# EAGLE design caja_negra (EAGLE 9.6.2)
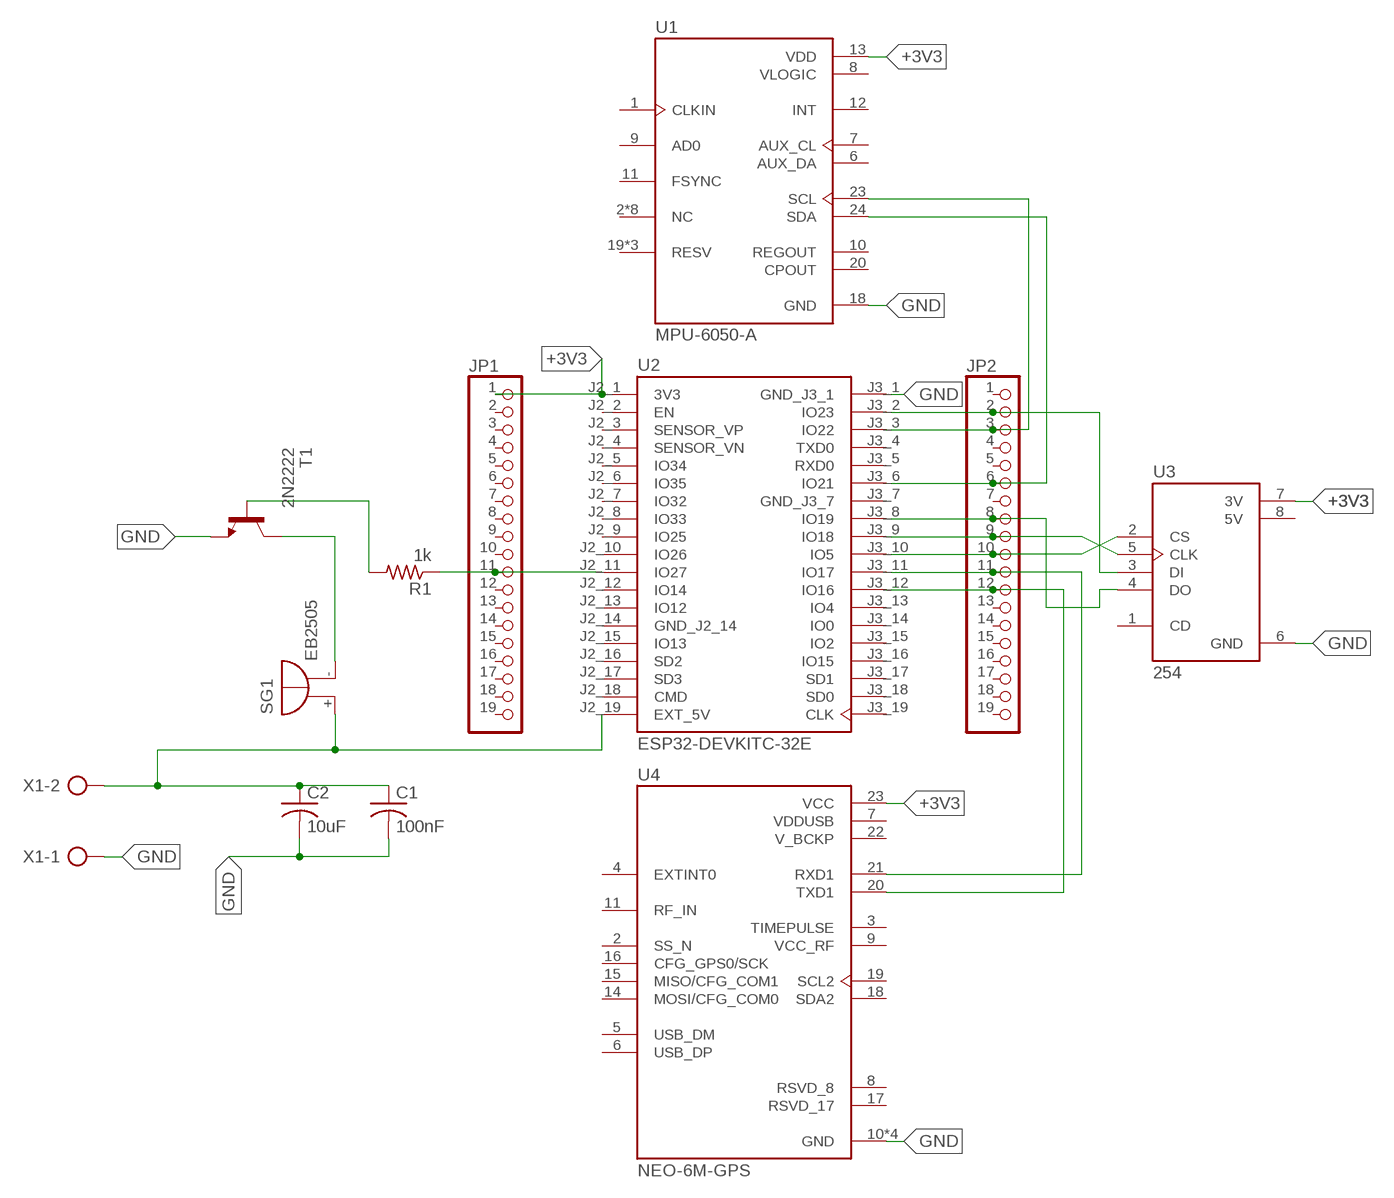
[diagram p0: schematic, sheet 1]

## Parts
C1  100nF  C-US025-024X044  [C025-024X044]
C2  10uF  C-US025-024X044  [C025-024X044]
JP1  PINHD-1X19  [1X19]
JP2  PINHD-1X19  [1X19]
R1  1k  R-US_0204/2V  [0204V]
SG1  EB2505  [EB2505]
T1  2N2222  [TO18]
U1  MPU-6050-A  [QFN50P400X400X95-24N]
U2  ESP32-DEVKITC-32E  [MODULE_ESP32-DEVKITC-32E]
U3  254  [MODULE_254]
U4  NEO-6M-GPS  [XCVR_NEO-6M-GPS]
X1  AK500/2-H  [AK500/2-H]

## Nets
+3V3: JP1.1 U1.13(VDD) U2.J2_1(3V3) U3.7(3V) U4.23(VCC)
GND: C1.2 C2.2 T1.1(E) U1.18(GND) U2.J3_1(GND_J3_1) U3.6(GND) U4.10(GND) U4.12(GND) U4.13(GND) U4.24(GND) X1.1
N$1: JP2.6 U1.24(SDA) U2.J3_6(IO21)
N$2: JP2.3 U1.23(SCL) U2.J3_3(IO22)
N$3: JP2.12 U2.J3_12(IO16) U4.20(TXD1)
N$4: JP2.11 U2.J3_11(IO17) U4.21(RXD1)
N$5: JP2.2 U2.J3_2(IO23) U3.3(DI)
N$6: JP2.10 U2.J3_10(IO5) U3.2(CS)
N$7: JP2.9 U2.J3_9(IO18) U3.5(CLK)
N$8: JP2.8 U2.J3_8(IO19) U3.4(DO)
N$9: JP1.11 R1.1 U2.J2_11(IO27)
N$11: C1.1 C2.1 SG1.+ U2.J2_19(EXT_5V) X1.2
N$12: SG1.- T1.3(C)
N$13: R1.2 T1.2(B)
Unconnected: JP1.2 JP1.3 JP1.4 JP1.5 JP1.6 JP1.7 JP1.8 JP1.9 JP1.10 JP1.12 JP1.13 JP1.14 JP1.15 JP1.16 JP1.17 JP1.18 JP1.19 JP2.1 JP2.4 JP2.5 JP2.7 JP2.13 JP2.14 JP2.15 JP2.16 JP2.17 JP2.18 JP2.19 U1.1(CLKIN) U1.2(NC) U1.3(NC) U1.4(NC) U1.5(NC) U1.6(AUX_DA) U1.7(AUX_CL) U1.9(AD0) U1.10(REGOUT) U1.11(FSYNC) U1.12(INT) U1.14(NC) U1.15(NC) U1.16(NC) U1.17(NC) U1.19(RESV) U1.20(CPOUT) U1.21(RESV) U1.22(RESV) U2.J2_2(EN) U2.J2_3(SENSOR_VP) U2.J2_4(SENSOR_VN) U2.J2_5(IO34) U2.J2_6(IO35) U2.J2_7(IO32) U2.J2_8(IO33) U2.J2_9(IO25) U2.J2_10(IO26) U2.J2_12(IO14) U2.J2_13(IO12) U2.J2_15(IO13) U2.J2_16(SD2) U2.J2_17(SD3) U2.J2_18(CMD) U2.J3_4(TXD0) U2.J3_5(RXD0) U2.J3_13(IO4) U2.J3_14(IO0) U2.J3_15(IO2) U2.J3_16(IO15) U2.J3_17(SD1) U2.J3_18(SD0) U2.J3_19(CLK) U3.1(CD) U4.2(SS_N) U4.3(TIMEPULSE) U4.4(EXTINT0) U4.5(USB_DM) U4.6(USB_DP) U4.8(RSVD_8) U4.9(VCC_RF) U4.11(RF_IN) U4.14(MOSI/CFG_COM0) U4.15(MISO/CFG_COM1) U4.16(CFG_GPS0/SCK) U4.17(RSVD_17) U4.18(SDA2) U4.19(SCL2)

## Power pins joined to a net without a drawn wire
5V: U3.8(5V)
GND_J2_14: U2.J2_14(GND_J2_14)
GND_J3_7: U2.J3_7(GND_J3_7)
V_BCKP: U4.22(V_BCKP)
VDDUSB: U4.7(VDDUSB)
VLOGIC: U1.8(VLOGIC)

## Library data of the parts
C1 C2 = rcl:C-US: CAPACITOR, American symbol; SPICEPREFIX: C
JP1 JP2 = pinhead:PINHD-1X19: PIN HEADER
R1 = rcl:R-US_: RESISTOR, American symbol; SPICEPREFIX: R
SG1 = buzzer:EB2505: BUZZER Source: Buerklin; OC_FARNELL: unknown; OC_NEWARK: unknown
T1 = transistor:2N2222: NPN TRANSISTOR
U1 = MPU-6050-A:MPU-6050-A: Check availability <https://pricing.snapeda.com/parts/MPU-6050-A/TDK%20InvenSense/view-part?ref=eda>; AVAILABILITY: In Stock; CHECK_PRICES: https://www.snapeda.com/parts/MPU-6050-A/TDK/view-part/?ref=eda; DESCRIPTION: MOTION TRACKING DEVICE; MF: TDK InvenSense; MP: MPU-6050-A; PACKAGE: QFN-24 InvenSense; PRICE: None; SNAPEDA_LINK: https://www.snapeda.com/parts/MPU-6050-A/TDK/view-part/?ref=snap
U2 = ESP32-DEVKITC-32E:ESP32-DEVKITC-32E: Check availability <https://pricing.snapeda.com/parts/ESP32-DEVKITC-32E/Espressif%20Systems/view-part?ref=eda>; AVAILABILITY: In Stock; CHECK_PRICES: https://www.snapeda.com/parts/ESP32-DEVKITC-32E/Espressif+Systems/view-part/?ref=eda; DESCRIPTION: The ESP32-DEVKITC-32E transceiver evaluation board from Espressif Systems is a powerful development tool for wireless communication technologies. It supports 802.11 b/g/n Wi-Fi and Bluetooth® Smart Ready 4.x (BLE) dual-mode at 2.4GHz, making it ideal for a variety of IoT applications. Equipped with a PCB antenna and 4MB flash, this board provides reliable connectivity and ample memory for developing and testing RF, RFID, and wireless solutions.; MF: Espressif Systems; MP: ESP32-DEVKITC-32E; PACKAGE: None; PRICE: None; PURCHASE-URL: https://www.snapeda.com/api/url_track_click_mouser/?unipart_id=4719025&manufacturer=Espressif Systems&part_name=ESP32-DEVKITC-32E&search_term=esp32 devkit; SNAPEDA_LINK: https://www.snapeda.com/parts/ESP32-DEVKITC-32E/Espressif+Systems/view-part/?ref=snap
U3 = 254:254: Check availability <https://pricing.snapeda.com/parts/254/Adafruit/view-part?ref=eda>; AVAILABILITY: In Stock; CHECK_PRICES: https://www.snapeda.com/parts/254/Adafruit+Industries/view-part/?ref=eda; DESCRIPTION: MicroSD card breakout board+ | Adafruit Industries 254; MF: Adafruit; MP: 254; PACKAGE: NON STANDARD Adafruit; PRICE: None; PURCHASE-URL: https://www.snapeda.com/api/url_track_click_mouser/?unipart_id=4653161&manufacturer=Adafruit&part_name=254&search_term=microsd (spi); SNAPEDA_LINK: https://www.snapeda.com/parts/254/Adafruit+Industries/view-part/?ref=snap
U4 = NEO-6M-GPS:NEO-6M-GPS: Check availability <https://pricing.snapeda.com/parts/NEO-6M-GPS/u-blox/view-part?ref=eda>; AVAILABILITY: Not in stock; CHECK_PRICES: https://www.snapeda.com/parts/NEO-6M-GPS/u-blox/view-part/?ref=eda; DESCRIPTION: GPS Development Tools SparkFun GNSS-RTK Dead Reckoning Breakout - ZED-F9K (Qwiic); MF: u-blox; MP: NEO-6M-GPS; PACKAGE: None; PRICE: None; SNAPEDA_LINK: https://www.snapeda.com/parts/NEO-6M-GPS/u-blox/view-part/?ref=snap
X1 = con-ptr500:AK500/2-H: CONNECTOR Aug. 2004 / PTR Meßtechnik: Die Bezeichnung der Serie AK505 wurde geändert. Es handelt sich hierbei um AK500 in horizontaler Ausführung.; OC_FARNELL: unknown; OC_NEWARK: unknown

## Board
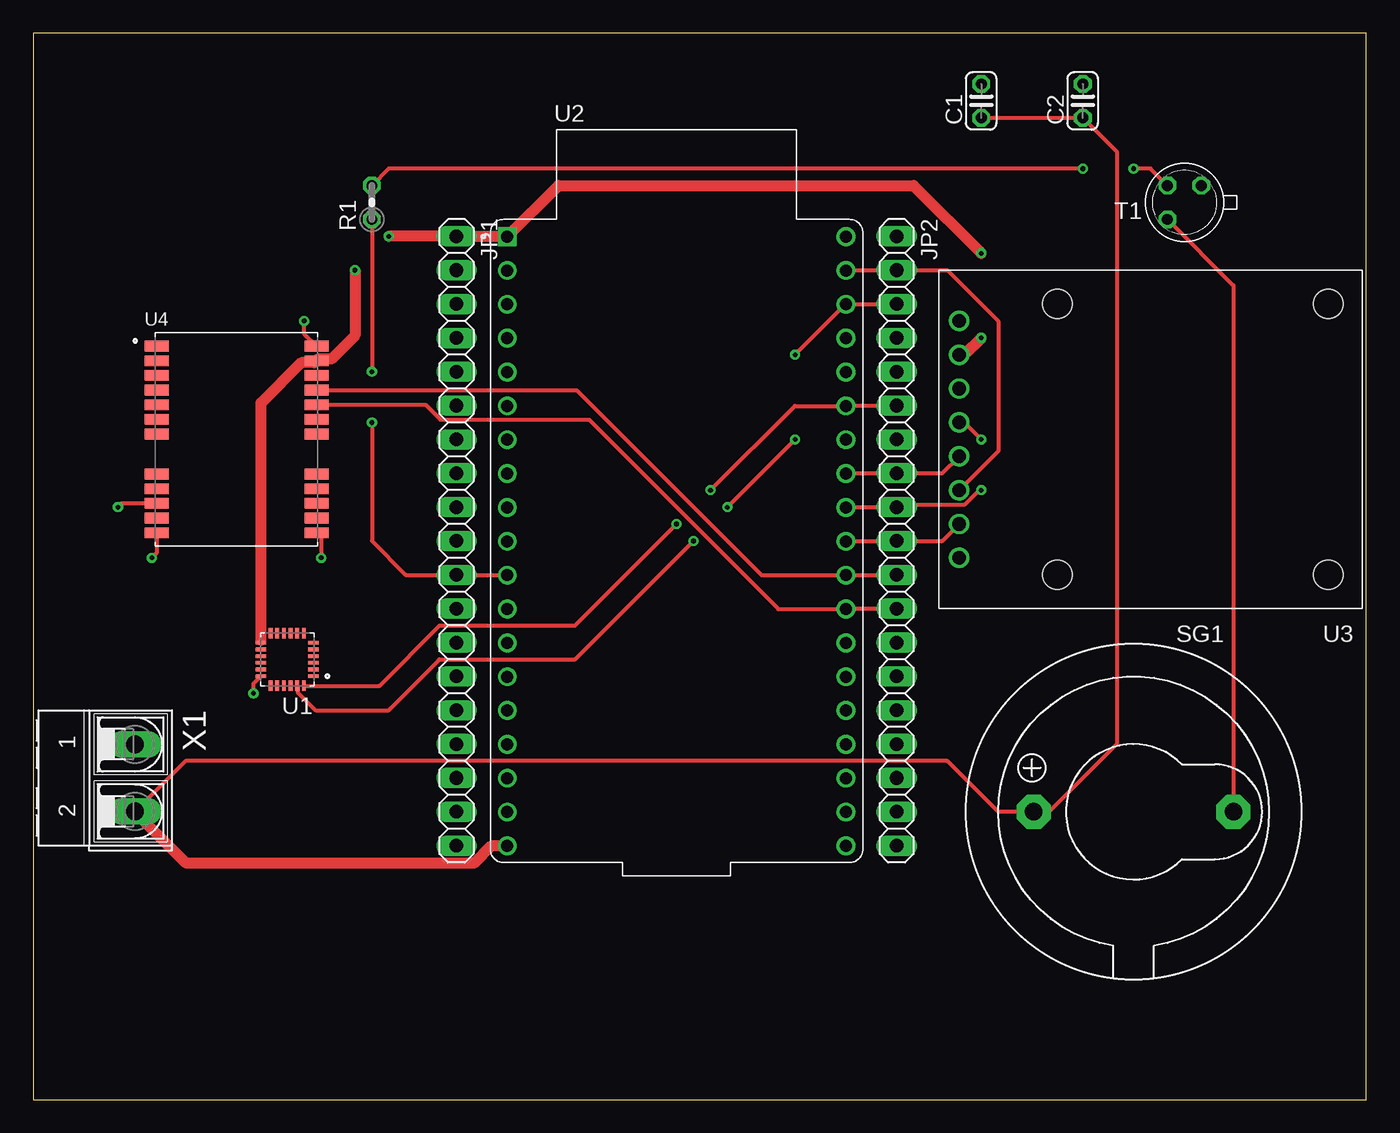
[diagram p1: board, top side]
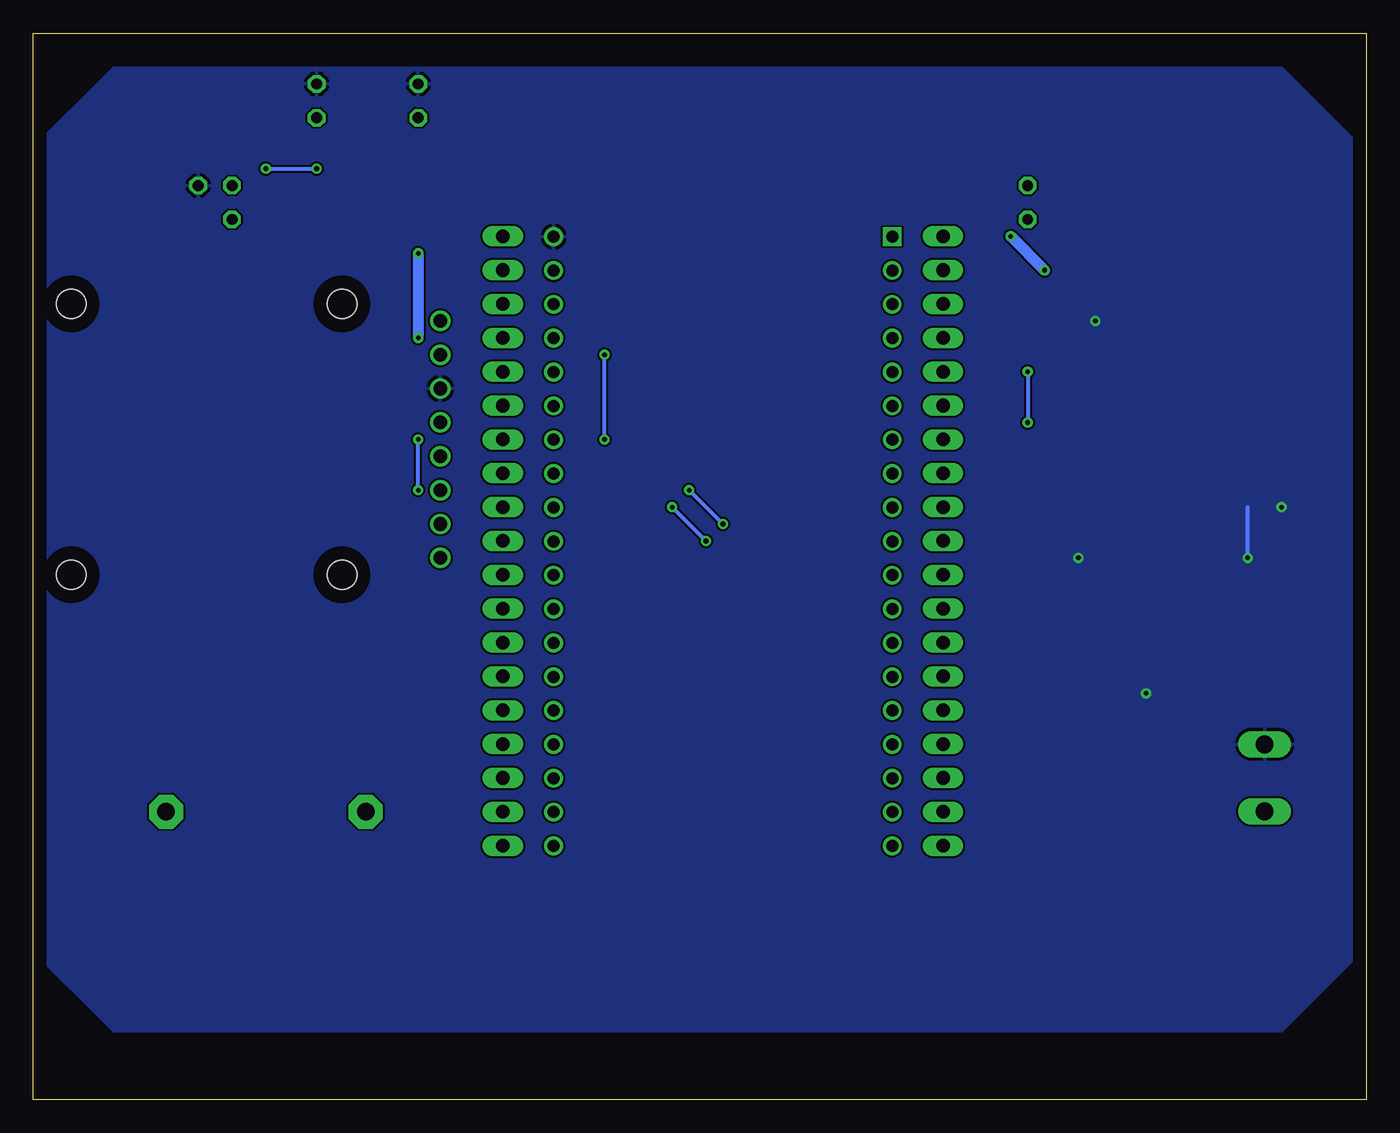
[diagram p2: board, bottom side, seen from below]

Size 100 x 80 mm. Coordinates in mm from the lower left corner, seen from the top.
Outline: 0,0 100,0 100,80 0,80 0,0
Copper layers (1*16): Top 0.035mm / dielectric 1.5mm / Bottom 0.035mm
Design rules "default": minimum track width 6mil, minimum drill 0.35mm, track to track 6mil, track to pad 6mil, pad to pad 6mil, via to via 6mil, smd to smd 6mil, copper to edge 40mil, drill to drill 6mil, minimum pad ring 10mil, minimum via ring 8mil, stop-mask expansion 4mil, vias tented up to drill 0mil, thermal gap 10mil

### Footprints (pad centres in the part's own frame; a part is rotated, then mirrored left to right if it is on the bottom)
C025-024X044 = drill 0.813 octagon: 1 -1.27,0; 2 1.27,0
1X19 = drill 1.016 long: 1 -22.86,0; 2 -20.32,0; 3 -17.78,0; 4 -15.24,0; 5 -12.7,0; 6 -10.16,0; 7 -7.62,0; 8 -5.08,0; 9 -2.54,0; 10 0,0; 11 2.54,0; 12 5.08,0; 13 7.62,0; 14 10.16,0; 15 12.7,0; 16 15.24,0; 17 17.78,0; 18 20.32,0; 19 22.86,0
0204V = drill 0.813 octagon: 1 -1.27,0; 2 1.27,0
EB2505 = drill 1.321 pad 2.54 octagon: + -7.493,0; - 7.493,0
TO18 = drill 0.813 octagon: 1 -1.27,-1.27; 2 1.27,-1.27; 3 1.27,1.27
QFN50P400X400X95-24N = smd 0.79 x 0.28: 1 -1.97,1.25; 2 -1.97,0.75; 3 -1.97,0.25; 4 -1.97,-0.25; 5 -1.97,-0.75; 6 -1.97,-1.25; 13 1.97,-1.25; 14 1.97,-0.75; 15 1.97,-0.25; 16 1.97,0.25; 17 1.97,0.75; 18 1.97,1.25 | smd 0.28 x 0.79: 7 -1.25,-1.97; 8 -0.75,-1.97; 9 -0.25,-1.97; 10 0.25,-1.97; 11 0.75,-1.97; 12 1.25,-1.97; 19 1.25,1.97; 20 0.75,1.97; 21 0.25,1.97; 22 -0.25,1.97; 23 -0.75,1.97; 24 -1.25,1.97
MODULE_ESP32-DEVKITC-32E = drill 0.9 square: J2_1 -12.7,22.835 | drill 0.9: J2_2 -12.7,20.295; J2_3 -12.7,17.755; J2_4 -12.7,15.215; J2_5 -12.7,12.675; J2_6 -12.7,10.135; J2_7 -12.7,7.595; J2_8 -12.7,5.055; J2_9 -12.7,2.515; J2_10 -12.7,-0.025; J2_11 -12.7,-2.565; J2_12 -12.7,-5.105; J2_13 -12.7,-7.645; J2_14 -12.7,-10.185; J2_15 -12.7,-12.725; J2_16 -12.7,-15.265; J2_17 -12.7,-17.805; J2_18 -12.7,-20.345; J2_19 -12.7,-22.885; J3_1 12.7,22.835; J3_2 12.7,20.295; J3_3 12.7,17.755; J3_4 12.7,15.215; J3_5 12.7,12.675; J3_6 12.7,10.135; J3_7 12.7,7.595; J3_8 12.7,5.055; J3_9 12.7,2.515; J3_10 12.7,-0.025; J3_11 12.7,-2.565; J3_12 12.7,-5.105; J3_13 12.7,-7.645; J3_14 12.7,-10.185; J3_15 12.7,-12.725; J3_16 12.7,-15.265; J3_17 12.7,-17.805; J3_18 12.7,-20.345; J3_19 12.7,-22.885
MODULE_254 = drill 1.02: 1 14.351,8.89; 2 14.351,6.35; 3 14.351,3.81; 4 14.351,1.27; 5 14.351,-1.27; 6 14.351,-3.81; 7 14.351,-6.35; 8 14.351,-8.89 | hole 2.2: -13.335,10.16; 6.985,10.16; 6.985,-10.16; -13.335,-10.16
XCVR_NEO-6M-GPS = smd 1.8 x 0.8: 1 -6,7; 2 -6,5.9; 3 -6,4.8; 4 -6,3.7; 5 -6,2.6; 6 -6,1.5; 7 -6,0.4; 8 -6,-2.6; 9 -6,-3.7; 10 -6,-4.8; 11 -6,-5.9; 12 -6,-7; 13 6,-7; 14 6,-5.9; 15 6,-4.8; 16 6,-3.7; 17 6,-2.6; 18 6,0.4; 19 6,1.5; 20 6,2.6; 21 6,3.7; 22 6,4.8; 23 6,5.9; 24 6,7
AK500/2-H = drill 1.321 long: 1 -2.515,0; 2 2.515,0

### Placement (x,y rotation side)
C1  71.12,74.93 90 top
C2  78.74,74.93 90 top
JP1  31.75,41.91 270 top
JP2  64.77,41.91 270 top
R1  25.4,67.31 90 top
SG1  82.55,21.59 0 top
T1  86.36,67.31 180 top
U1  19.05,33.02 180 top
U2  48.26,41.91 0 top
U3  83.82,49.53 180 top
U4  15.24,49.53 0 top
X1  7.62,24.13 270 top

### Tracks (layer width: path | path; a pad name or v marks a point on that pad's centre or on a via)
+3V3  (via drill 0.35)
  Top 0.305: U1.13 17.08,34.47
  Top 0.813: v26.67,64.77 JP1.1 31.77,64.75 U2.J2_1 39.4,68.58 66.04,68.58 v71.12,63.5 | v24.13,62.23 24.13,57.33 22.37,55.57 21.38,55.57 U4.23 21.1,55.29 20.11,55.29 17.08,52.26 17.08,34.47 | v71.12,57.15 69.85,55.88 U3.7
  Bottom 0.813: v26.67,64.77 v24.13,62.23 | v71.12,63.5 v71.12,57.15
GND  (via drill 0.35)
  Top 0.305: U1.18 16.51,31.2 v16.51,30.48 | U4.13 21.59,42.18 v21.59,40.64 | U4.12 9.24,40.99 v8.89,40.64 | U4.10 6.63,44.73 v6.35,44.45 | U4.24 20.32,57.45 v20.32,58.42
  Bottom 0.305: v8.89,40.64 8.89,44.45
  pour Bottom: 0,64.77 0,11.43 6.35,5.08 93.98,5.08 100.33,11.43 100.33,71.12 93.98,77.47 6.35,77.47 0,71.12
N$1  (via drill 0.35)
  Top 0.305: U1.24 25.97,31.05 30.48,35.56 40.64,35.56 v48.26,43.18 | v50.8,45.72 57.12,52.05 U2.J3_6 60.98,52.07 JP2.6
  Bottom 0.305: v48.26,43.18 v50.8,45.72
N$2  (via drill 0.35)
  Top 0.305: U1.23 19.84,31.01 19.84,30.54 21.17,29.21 26.67,29.21 30.48,33.02 40.64,33.02 v49.53,41.91 | v52.07,44.45 v57.15,49.53 | v57.15,55.88 60.94,59.66 U2.J3_3 60.98,59.69 JP2.3
  Bottom 0.305: v49.53,41.91 v52.07,44.45 | v57.15,49.53 v57.15,55.88
N$3
  Top 0.305: U4.20 29.42,52.13 30.55,51 41.71,51 55.91,36.8 U2.J3_12 60.98,36.83 JP2.12
N$4
  Top 0.305: U4.21 40.75,53.23 54.63,39.34 U2.J3_11 64.75,39.34 JP2.11
N$5
  Top 0.305: U2.J3_2 60.98,62.23 JP2.2 68.58,62.23 72.39,58.42 72.39,48.64 U3.3
N$6
  Top 0.305: U2.J3_10 60.98,41.91 JP2.10 68.2,41.91 U3.2
N$7  (via drill 0.35)
  Top 0.305: U2.J3_9 60.98,44.45 JP2.9 64.97,44.65 69.91,44.65 70.98,45.72 v71.12,45.72 | U3.5 69.85,50.8 v71.12,49.53
  Bottom 0.305: v71.12,45.72 v71.12,49.53
N$8
  Top 0.305: U2.J3_8 60.98,46.99 JP2.8 68.2,46.99 U3.4
N$9  (via drill 0.35)
  Top 0.305: R1.1 v25.4,54.61 | v25.4,50.8 25.4,41.91 27.94,39.37 JP1.11 35.53,39.37 U2.J2_11
  Bottom 0.305: v25.4,54.61 v25.4,50.8
N$11
  Top 0.305: C1.1 C2.1 81.28,71.12 81.28,26.67 76.2,21.59 SG1.+ 72.39,21.59 68.58,25.4 11.43,25.4 7.62,21.59 X1.2 | 35.56,19.05 U2.J2_19
  Top 0.813: 7.62,21.59 11.48,17.73 33.06,17.73 34.35,19.02 U2.J2_19
N$12
  Top 0.305: T1.3 90.04,61.09 SG1.-
N$13  (via drill 0.35)
  Top 0.305: T1.2 83.82,69.85 v82.55,69.85 | R1.2 26.67,69.85 v78.74,69.85
  Bottom 0.305: v82.55,69.85 v78.74,69.85